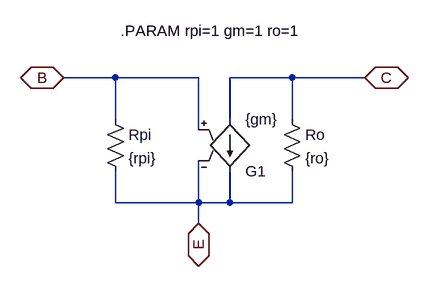
[diagram p0: schematic npn_small_signal.asc]
npn_small_signal.asc, the LTspice schematic file:
Version 4
SHEET 1 880 680
WIRE 160 48 80 48
WIRE 288 48 160 48
WIRE 432 48 336 48
WIRE 544 48 432 48
WIRE 160 112 160 48
WIRE 336 112 336 48
WIRE 432 112 432 48
WIRE 288 128 288 48
WIRE 160 240 160 192
WIRE 288 240 288 176
WIRE 288 240 160 240
WIRE 336 240 336 192
WIRE 336 240 288 240
WIRE 432 240 432 192
WIRE 432 240 336 240
WIRE 288 272 288 240
FLAG 80 48 B
IOPIN 80 48 BiDir
FLAG 544 48 C
IOPIN 544 48 BiDir
FLAG 288 272 E
IOPIN 288 272 BiDir
SYMBOL res 144 96 R0
SYMATTR InstName Rpi
SYMATTR Value {rpi}
SYMBOL g2 336 208 M180
SYMATTR InstName G1
SYMATTR Value {gm}
SYMBOL res 416 96 R0
SYMATTR InstName Ro
SYMATTR Value {ro}
TEXT 168 -24 Left 2 !.PARAM rpi=1 gm=1 ro=1

The netlist it stands for:
* npn_small_signal.asc
Rpi B E {rpi}
G1 C E B E {gm}
Ro C E {ro}
.PARAM rpi=1 gm=1 ro=1
.backanno
.end